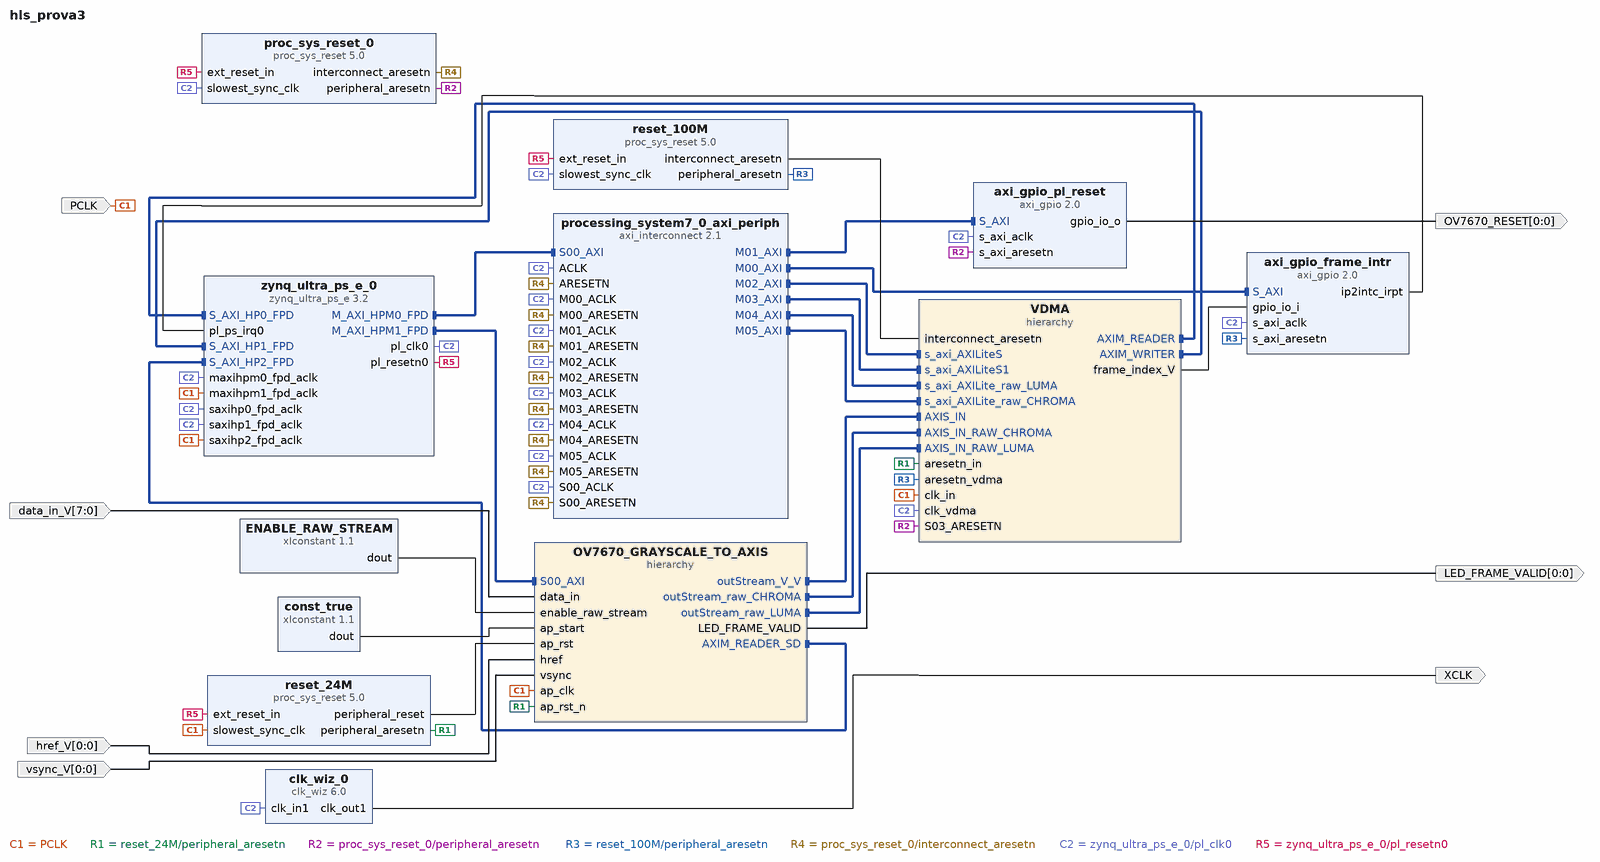
[diagram p0: block diagram of the top level]
# Vivado block design hls_prova3, xczu3eg-sbva484-1-e, Vivado 2018.1
create_bd_design hls_prova3

create_bd_port -dir O -from 0 -to 0 -type data LED_FRAME_VALID
create_bd_port -dir I -type clk PCLK
set_property -dict {CONFIG.FREQ_HZ 24000000} [get_bd_ports PCLK]
create_bd_port -dir O -type clk XCLK
create_bd_port -dir I -from 7 -to 0 -type data data_in_V
set_property -dict [list \
  CONFIG.LAYERED_METADATA {xilinx.com:interface:datatypes:1.0 {DATA {datatype {name {attribs {resolve_type immediate dependency {} format string minimum {} maximum {}} value {}} bitwidth {attribs {resolve_type immediate dependency {} format long minimum {} maximum {}} value 8} bitoffset {attribs {resolve_type immediate dependency {} format long minimum {} maximum {}} value 0} integer {signed {attribs {resolve_type immediate dependency {} format bool minimum {} maximum {}} value false}}}}}} \
] [get_bd_ports data_in_V]
create_bd_port -dir O -from 0 -to 0 -type rst OV7670_RESET
create_bd_port -dir I -from 0 -to 0 -type data href_V
set_property -dict [list \
  CONFIG.LAYERED_METADATA {xilinx.com:interface:datatypes:1.0 {DATA {datatype {name {attribs {resolve_type immediate dependency {} format string minimum {} maximum {}} value {}} bitwidth {attribs {resolve_type immediate dependency {} format long minimum {} maximum {}} value 1} bitoffset {attribs {resolve_type immediate dependency {} format long minimum {} maximum {}} value 0} integer {signed {attribs {resolve_type immediate dependency {} format bool minimum {} maximum {}} value false}}}}}} \
] [get_bd_ports href_V]
create_bd_port -dir I -from 0 -to 0 -type data vsync_V
set_property -dict [list \
  CONFIG.LAYERED_METADATA {xilinx.com:interface:datatypes:1.0 {DATA {datatype {name {attribs {resolve_type immediate dependency {} format string minimum {} maximum {}} value {}} bitwidth {attribs {resolve_type immediate dependency {} format long minimum {} maximum {}} value 1} bitoffset {attribs {resolve_type immediate dependency {} format long minimum {} maximum {}} value 0} integer {signed {attribs {resolve_type immediate dependency {} format bool minimum {} maximum {}} value false}}}}}} \
] [get_bd_ports vsync_V]

create_bd_cell -type ip -vlnv xilinx.com:ip:xlconstant:1.1 ENABLE_RAW_STREAM
set_property -dict {CONFIG.CONST_VAL 1} [get_bd_cells ENABLE_RAW_STREAM]
create_bd_cell -type hier OV7670_GRAYSCALE_TO_AXIS
create_bd_cell -type hier VDMA
create_bd_cell -type ip -vlnv xilinx.com:ip:axi_gpio:2.0 axi_gpio_frame_intr
set_property -dict {CONFIG.C_GPIO_WIDTH 8 CONFIG.C_ALL_INPUTS 1 CONFIG.C_INTERRUPT_PRESENT 1} [get_bd_cells axi_gpio_frame_intr]
create_bd_cell -type ip -vlnv xilinx.com:ip:axi_gpio:2.0 axi_gpio_pl_reset
set_property -dict [list \
  CONFIG.C_GPIO_WIDTH 1 \
  CONFIG.C_ALL_INPUTS 0 \
  CONFIG.C_DOUT_DEFAULT 0x00000001 \
  CONFIG.C_ALL_OUTPUTS 1 \
] [get_bd_cells axi_gpio_pl_reset]
create_bd_cell -type ip -vlnv xilinx.com:ip:clk_wiz:6.0 clk_wiz_0
set_property -dict [list \
  CONFIG.USE_PHASE_ALIGNMENT true \
  CONFIG.PHASESHIFT_MODE WAVEFORM \
  CONFIG.SECONDARY_SOURCE Single_ended_clock_capable_pin \
  CONFIG.CLKOUT1_USED true \
  CONFIG.CLKOUT2_USED false \
  CONFIG.NUM_OUT_CLKS 1 \
  CONFIG.CLKOUT1_REQUESTED_OUT_FREQ 24.001 \
  CONFIG.CLKOUT2_REQUESTED_OUT_FREQ 100.000 \
  CONFIG.CLKOUT1_DRIVES Buffer \
  CONFIG.CLKOUT2_DRIVES Buffer \
  CONFIG.CLKOUT3_DRIVES Buffer \
  CONFIG.CLKOUT4_DRIVES Buffer \
  CONFIG.CLKOUT5_DRIVES Buffer \
  CONFIG.CLKOUT6_DRIVES Buffer \
  CONFIG.CLKOUT7_DRIVES Buffer \
  CONFIG.USE_LOCKED false \
  CONFIG.USE_RESET false \
  CONFIG.MMCM_DIVCLK_DIVIDE 6 \
  CONFIG.MMCM_CLKFBOUT_MULT_F 60.125 \
  CONFIG.MMCM_CLKOUT0_DIVIDE_F 41.750 \
  CONFIG.MMCM_CLKOUT1_DIVIDE 1 \
  CONFIG.CLKOUT1_JITTER 329.137 \
  CONFIG.CLKOUT1_PHASE_ERROR 404.105 \
  CONFIG.CLKOUT2_JITTER 204.875 \
  CONFIG.CLKOUT2_PHASE_ERROR 276.131 \
] [get_bd_cells clk_wiz_0]
create_bd_cell -type ip -vlnv xilinx.com:ip:xlconstant:1.1 const_true
create_bd_cell -type ip -vlnv xilinx.com:ip:proc_sys_reset:5.0 proc_sys_reset_0
create_bd_cell -type ip -vlnv xilinx.com:ip:axi_interconnect:2.1 processing_system7_0_axi_periph
set_property -dict {CONFIG.NUM_MI 6 CONFIG.SYNCHRONIZATION_STAGES 2} [get_bd_cells processing_system7_0_axi_periph]
create_bd_cell -type ip -vlnv xilinx.com:ip:proc_sys_reset:5.0 reset_100M
create_bd_cell -type ip -vlnv xilinx.com:ip:proc_sys_reset:5.0 reset_24M
create_bd_cell -type ip -vlnv xilinx.com:ip:zynq_ultra_ps_e:3.2 zynq_ultra_ps_e_0
set_property -dict [list \
  CONFIG.PSU__PSS_REF_CLK__FREQMHZ 33.333333 \
  CONFIG.PSU__CAN1__PERIPHERAL__ENABLE 0 \
  CONFIG.PSU__DPAUX__PERIPHERAL__ENABLE 1 \
  CONFIG.PSU__DPAUX__PERIPHERAL__IO {MIO 27 .. 30} \
  CONFIG.PSU__FPGA_PL0_ENABLE 1 \
  CONFIG.PSU__ENET3__PERIPHERAL__ENABLE 0 \
  CONFIG.PSU__GPIO0_MIO__PERIPHERAL__ENABLE 1 \
  CONFIG.PSU__GPIO0_MIO__IO {MIO 0 .. 25} \
  CONFIG.PSU__GPIO1_MIO__PERIPHERAL__ENABLE 1 \
  CONFIG.PSU__GPIO1_MIO__IO {MIO 26 .. 51} \
  CONFIG.PSU__GPIO2_MIO__PERIPHERAL__ENABLE 1 \
  CONFIG.PSU__GPIO2_MIO__IO {MIO 52 .. 77} \
  CONFIG.PSU__I2C0__PERIPHERAL__ENABLE 0 \
  CONFIG.PSU__I2C1__PERIPHERAL__ENABLE 1 \
  CONFIG.PSU__I2C1__PERIPHERAL__IO {MIO 4 .. 5} \
  CONFIG.PSU__GT__LINK_SPEED HBR \
  CONFIG.PSU__GT__VLT_SWNG_LVL_4 0 \
  CONFIG.PSU__GT__PRE_EMPH_LVL_4 0 \
  CONFIG.PSU__USB0__REF_CLK_SEL {Ref Clk0} \
  CONFIG.PSU__USB0__REF_CLK_FREQ 26 \
  CONFIG.PSU__USB1__REF_CLK_SEL {Ref Clk0} \
  CONFIG.PSU__USB1__REF_CLK_FREQ 26 \
  CONFIG.PSU__DP__REF_CLK_SEL {Ref Clk1} \
  CONFIG.PSU__DP__REF_CLK_FREQ 27 \
  CONFIG.PSU__DP__LANE_SEL {Dual Lower} \
  CONFIG.SUBPRESET1 Custom \
  CONFIG.SUBPRESET2 Custom \
  CONFIG.PSU__PMU__AIBACK__ENABLE 0 \
  CONFIG.PSU__PMU__PLERROR__ENABLE 0 \
  CONFIG.PSU__PMU__PERIPHERAL__ENABLE 1 \
  CONFIG.PSU__PMU__EMIO_GPI__ENABLE 0 \
  CONFIG.PSU__PMU__EMIO_GPO__ENABLE 0 \
  CONFIG.PSU__PMU__GPI0__ENABLE 1 \
  CONFIG.PSU__PMU__GPI1__ENABLE 0 \
  CONFIG.PSU__PMU__GPI2__ENABLE 0 \
  CONFIG.PSU__PMU__GPI3__ENABLE 0 \
  CONFIG.PSU__PMU__GPI4__ENABLE 0 \
  CONFIG.PSU__PMU__GPI5__ENABLE 0 \
  CONFIG.PSU__PMU__GPO0__ENABLE 1 \
  CONFIG.PSU__PMU__GPO1__ENABLE 1 \
  CONFIG.PSU__PMU__GPO2__ENABLE 1 \
  CONFIG.PSU__PMU__GPO3__ENABLE 0 \
  CONFIG.PSU__PMU__GPO4__ENABLE 0 \
  CONFIG.PSU__PMU__GPO5__ENABLE 0 \
  CONFIG.PSU__PMU__GPI0__IO {MIO 26} \
  CONFIG.PSU__PMU__GPO0__IO {MIO 32} \
  CONFIG.PSU__PMU__GPO1__IO {MIO 33} \
  CONFIG.PSU__PMU__GPO2__IO {MIO 34} \
  CONFIG.PSU__PMU__GPO2__POLARITY high \
  CONFIG.PSU__QSPI__PERIPHERAL__ENABLE 0 \
  CONFIG.PSU__SD0__PERIPHERAL__ENABLE 1 \
  CONFIG.PSU__SD0__PERIPHERAL__IO {MIO 13 .. 16 21 22} \
  CONFIG.PSU__SD0__GRP_CD__ENABLE 1 \
  CONFIG.PSU__SD0__GRP_CD__IO {MIO 24} \
  CONFIG.PSU__SD0__SLOT_TYPE {SD 2.0} \
  CONFIG.PSU__SD0__DATA_TRANSFER_MODE 4Bit \
  CONFIG.PSU__SD1__PERIPHERAL__ENABLE 1 \
  CONFIG.PSU__SD1__PERIPHERAL__IO {MIO 46 .. 51} \
  CONFIG.PSU__SD1__GRP_CD__ENABLE 0 \
  CONFIG.PSU__SD1__GRP_POW__ENABLE 0 \
  CONFIG.PSU__SD1__GRP_WP__ENABLE 0 \
  CONFIG.PSU__SD1__SLOT_TYPE {SD 2.0} \
  CONFIG.PSU__SD1__DATA_TRANSFER_MODE 4Bit \
  CONFIG.PSU__DEVICE_TYPE EG \
  CONFIG.PSU__SPI0__PERIPHERAL__ENABLE 1 \
  CONFIG.PSU__SPI0__PERIPHERAL__IO {MIO 38 .. 43} \
  CONFIG.PSU__SPI0__GRP_SS0__IO {MIO 41} \
  CONFIG.PSU__SPI1__PERIPHERAL__ENABLE 1 \
  CONFIG.PSU__SPI1__PERIPHERAL__IO {MIO 6 .. 11} \
  CONFIG.PSU__SPI1__GRP_SS0__IO {MIO 9} \
  CONFIG.PSU__SWDT0__PERIPHERAL__ENABLE 1 \
  CONFIG.PSU__SWDT0__CLOCK__ENABLE 0 \
  CONFIG.PSU__SWDT0__RESET__ENABLE 0 \
  CONFIG.PSU__SWDT1__PERIPHERAL__ENABLE 1 \
  CONFIG.PSU__SWDT1__CLOCK__ENABLE 0 \
  CONFIG.PSU__SWDT1__RESET__ENABLE 0 \
  CONFIG.PSU__UART0__BAUD_RATE 115200 \
  CONFIG.PSU__TTC0__PERIPHERAL__ENABLE 1 \
  CONFIG.PSU__TTC0__CLOCK__ENABLE 0 \
  CONFIG.PSU__TTC0__WAVEOUT__ENABLE 0 \
  CONFIG.PSU__TTC1__PERIPHERAL__ENABLE 1 \
  CONFIG.PSU__UART1__BAUD_RATE 115200 \
  CONFIG.PSU__TTC1__CLOCK__ENABLE 0 \
  CONFIG.PSU__TTC1__WAVEOUT__ENABLE 0 \
  CONFIG.PSU__TTC2__PERIPHERAL__ENABLE 1 \
  CONFIG.PSU__TTC2__CLOCK__ENABLE 0 \
  CONFIG.PSU__TTC2__WAVEOUT__ENABLE 0 \
  CONFIG.PSU__TTC3__PERIPHERAL__ENABLE 1 \
  CONFIG.PSU__TTC3__CLOCK__ENABLE 0 \
  CONFIG.PSU__TTC3__WAVEOUT__ENABLE 0 \
  CONFIG.PSU__CSUPMU__PERIPHERAL__VALID 1 \
  CONFIG.PSU__DDRC__BUS_WIDTH {32 Bit} \
  CONFIG.PSU__DDRC__DEVICE_CAPACITY {16384 MBits} \
  CONFIG.PSU__DDRC__DRAM_WIDTH {32 Bits} \
  CONFIG.PSU__DDRC__ECC Disabled \
  CONFIG.PSU__DDRC__MEMORY_TYPE {LPDDR 4} \
  CONFIG.PSU__DDRC__SPEED_BIN LPDDR4_1066 \
  CONFIG.PSU__UART0__PERIPHERAL__ENABLE 1 \
  CONFIG.PSU__UART0__PERIPHERAL__IO {MIO 2 .. 3} \
  CONFIG.PSU__UART0__MODEM__ENABLE 0 \
  CONFIG.PSU__UART1__PERIPHERAL__ENABLE 1 \
  CONFIG.PSU__UART1__PERIPHERAL__IO {MIO 0 .. 1} \
  CONFIG.PSU__UART1__MODEM__ENABLE 0 \
  CONFIG.PSU__USB0__PERIPHERAL__ENABLE 1 \
  CONFIG.PSU__USB0__PERIPHERAL__IO {MIO 52 .. 63} \
  CONFIG.PSU__USB1__PERIPHERAL__ENABLE 1 \
  CONFIG.PSU__USB1__PERIPHERAL__IO {MIO 64 .. 75} \
  CONFIG.PSU__USB3_0__PERIPHERAL__ENABLE 1 \
  CONFIG.PSU__USB3_0__PERIPHERAL__IO {GT Lane2} \
  CONFIG.PSU__USB3_1__PERIPHERAL__ENABLE 1 \
  CONFIG.PSU__USB3_1__PERIPHERAL__IO {GT Lane3} \
  CONFIG.PSU__USB3_0__EMIO__ENABLE 0 \
  CONFIG.PSU__USB2_0__EMIO__ENABLE 0 \
  CONFIG.PSU__USE__M_AXI_GP0 1 \
  CONFIG.PSU__MAXIGP0__DATA_WIDTH 128 \
  CONFIG.PSU__USE__M_AXI_GP1 1 \
  CONFIG.PSU__USE__M_AXI_GP2 0 \
  CONFIG.PSU__USE__S_AXI_GP2 1 \
  CONFIG.PSU__SAXIGP2__DATA_WIDTH 64 \
  CONFIG.PSU__USE__S_AXI_GP3 1 \
  CONFIG.PSU__SAXIGP3__DATA_WIDTH 64 \
  CONFIG.PSU__USE__S_AXI_GP4 1 \
  CONFIG.PSU__SAXIGP4__DATA_WIDTH 64 \
  CONFIG.PSU__USE__IRQ0 1 \
  CONFIG.PSU__PRESET_APPLIED 1 \
  CONFIG.PSU__HIGH_ADDRESS__ENABLE 0 \
  CONFIG.PSU__DDR_HIGH_ADDRESS_GUI_ENABLE 0 \
  CONFIG.PSU_BANK_0_IO_STANDARD LVCMOS18 \
  CONFIG.PSU_BANK_1_IO_STANDARD LVCMOS18 \
  CONFIG.PSU_BANK_2_IO_STANDARD LVCMOS18 \
  CONFIG.PSU_BANK_3_IO_STANDARD LVCMOS18 \
  CONFIG.PSU__CRL_APB__IOPLL_CTRL__DIV2 0 \
  CONFIG.PSU__DISPLAYPORT__PERIPHERAL__ENABLE 1 \
  CONFIG.PSU__DISPLAYPORT__LANE0__ENABLE 1 \
  CONFIG.PSU__DISPLAYPORT__LANE0__IO {GT Lane1} \
  CONFIG.PSU__DISPLAYPORT__LANE1__ENABLE 1 \
  CONFIG.PSU__DISPLAYPORT__LANE1__IO {GT Lane0} \
  CONFIG.PSU__SATA__PERIPHERAL__ENABLE 0 \
  CONFIG.PSU__CRL_APB__USB3__ENABLE 1 \
  CONFIG.PSU__CRF_APB__APLL_CTRL__SRCSEL PSS_REF_CLK \
  CONFIG.PSU__CRF_APB__DPLL_CTRL__SRCSEL PSS_REF_CLK \
  CONFIG.PSU__CRF_APB__VPLL_CTRL__SRCSEL PSS_REF_CLK \
  CONFIG.PSU__CRF_APB__ACPU_CTRL__SRCSEL APLL \
  CONFIG.PSU__CRF_APB__DBG_TRACE_CTRL__SRCSEL IOPLL \
  CONFIG.PSU__CRF_APB__DBG_FPD_CTRL__SRCSEL IOPLL \
  CONFIG.PSU__CRF_APB__DP_VIDEO_REF_CTRL__SRCSEL VPLL \
  CONFIG.PSU__CRF_APB__DP_AUDIO_REF_CTRL__SRCSEL RPLL \
  CONFIG.PSU__CRF_APB__DP_STC_REF_CTRL__SRCSEL RPLL \
  CONFIG.PSU__CRF_APB__DDR_CTRL__SRCSEL DPLL \
  CONFIG.PSU__CRF_APB__GPU_REF_CTRL__SRCSEL IOPLL \
  CONFIG.PSU__CRL_APB__PL0_REF_CTRL__SRCSEL IOPLL \
  CONFIG.PSU__CRF_APB__GDMA_REF_CTRL__SRCSEL APLL \
  CONFIG.PSU__CRF_APB__DPDMA_REF_CTRL__SRCSEL APLL \
  CONFIG.PSU__CRF_APB__TOPSW_MAIN_CTRL__SRCSEL DPLL \
  CONFIG.PSU__CRF_APB__TOPSW_LSBUS_CTRL__SRCSEL IOPLL \
  CONFIG.PSU__CRF_APB__DBG_TSTMP_CTRL__SRCSEL IOPLL \
  CONFIG.PSU__CRL_APB__IOPLL_CTRL__SRCSEL PSS_REF_CLK \
  CONFIG.PSU__CRL_APB__RPLL_CTRL__SRCSEL PSS_REF_CLK \
  CONFIG.PSU__CRL_APB__GEM3_REF_CTRL__SRCSEL IOPLL \
  CONFIG.PSU__CRL_APB__USB0_BUS_REF_CTRL__SRCSEL IOPLL \
  CONFIG.PSU__CRL_APB__QSPI_REF_CTRL__SRCSEL IOPLL \
  CONFIG.PSU__CRL_APB__SDIO0_REF_CTRL__SRCSEL IOPLL \
  CONFIG.PSU__CRL_APB__SDIO1_REF_CTRL__SRCSEL IOPLL \
  CONFIG.PSU__CRL_APB__UART0_REF_CTRL__SRCSEL IOPLL \
  CONFIG.PSU__CRL_APB__UART1_REF_CTRL__SRCSEL IOPLL \
  CONFIG.PSU__CRL_APB__I2C0_REF_CTRL__SRCSEL IOPLL \
  CONFIG.PSU__CRL_APB__I2C1_REF_CTRL__SRCSEL IOPLL \
  CONFIG.PSU__CRL_APB__SPI0_REF_CTRL__SRCSEL IOPLL \
  CONFIG.PSU__CRL_APB__SPI1_REF_CTRL__SRCSEL IOPLL \
  CONFIG.PSU__CRL_APB__CAN1_REF_CTRL__SRCSEL IOPLL \
  CONFIG.PSU__CRL_APB__CPU_R5_CTRL__SRCSEL IOPLL \
  CONFIG.PSU__CRL_APB__IOU_SWITCH_CTRL__SRCSEL IOPLL \
  CONFIG.PSU__CRL_APB__CSU_PLL_CTRL__SRCSEL IOPLL \
  CONFIG.PSU__CRL_APB__PCAP_CTRL__SRCSEL IOPLL \
  CONFIG.PSU__CRL_APB__LPD_LSBUS_CTRL__SRCSEL IOPLL \
  CONFIG.PSU__CRL_APB__LPD_SWITCH_CTRL__SRCSEL IOPLL \
  CONFIG.PSU__CRL_APB__DBG_LPD_CTRL__SRCSEL IOPLL \
  CONFIG.PSU__CRL_APB__ADMA_REF_CTRL__SRCSEL IOPLL \
  CONFIG.PSU__CRL_APB__TIMESTAMP_REF_CTRL__SRCSEL IOPLL \
  CONFIG.PSU__CRL_APB__USB3_DUAL_REF_CTRL__SRCSEL IOPLL \
  CONFIG.PSU__IOU_SLCR__IOU_TTC_APB_CLK__TTC0_SEL APB \
  CONFIG.PSU__IOU_SLCR__IOU_TTC_APB_CLK__TTC1_SEL APB \
  CONFIG.PSU__IOU_SLCR__IOU_TTC_APB_CLK__TTC2_SEL APB \
  CONFIG.PSU__IOU_SLCR__IOU_TTC_APB_CLK__TTC3_SEL APB \
  CONFIG.PSU__CRF_APB__VPLL_FRAC_CFG__ENABLED 1 \
  CONFIG.PSU__CRL_APB__RPLL_FRAC_CFG__ENABLED 1 \
  CONFIG.PSU__OVERRIDE__BASIC_CLOCK 1 \
  CONFIG.PSU__DLL__ISUSED 1 \
  CONFIG.PSU__DDR__INTERFACE__FREQMHZ 266.500 \
  CONFIG.PSU__CRF_APB__ACPU_CTRL__FREQMHZ 1200 \
  CONFIG.PSU__CRF_APB__DBG_TRACE_CTRL__FREQMHZ 250 \
  CONFIG.PSU__CRF_APB__DBG_FPD_CTRL__FREQMHZ 250 \
  CONFIG.PSU__CRF_APB__DDR_CTRL__FREQMHZ 533 \
  CONFIG.PSU__CRF_APB__GPU_REF_CTRL__FREQMHZ 600 \
  CONFIG.PSU__CRL_APB__PL0_REF_CTRL__FREQMHZ 100 \
  CONFIG.PSU__CRF_APB__GDMA_REF_CTRL__FREQMHZ 600 \
  CONFIG.PSU__CRF_APB__DPDMA_REF_CTRL__FREQMHZ 600 \
  CONFIG.PSU__CRF_APB__TOPSW_MAIN_CTRL__FREQMHZ 533.333 \
  CONFIG.PSU__CRF_APB__TOPSW_LSBUS_CTRL__FREQMHZ 100 \
  CONFIG.PSU__CRF_APB__DBG_TSTMP_CTRL__FREQMHZ 250 \
  CONFIG.PSU__CRL_APB__GEM3_REF_CTRL__FREQMHZ 125 \
  CONFIG.PSU__CRL_APB__USB0_BUS_REF_CTRL__FREQMHZ 250 \
  CONFIG.PSU__CRL_APB__QSPI_REF_CTRL__FREQMHZ 300 \
  CONFIG.PSU__CRL_APB__SDIO1_REF_CTRL__FREQMHZ 200 \
  CONFIG.PSU__CRL_APB__UART0_REF_CTRL__FREQMHZ 100 \
  CONFIG.PSU__CRL_APB__UART1_REF_CTRL__FREQMHZ 100 \
  CONFIG.PSU__CRL_APB__I2C0_REF_CTRL__FREQMHZ 100 \
  CONFIG.PSU__CRL_APB__I2C1_REF_CTRL__FREQMHZ 100 \
  CONFIG.PSU__CRL_APB__CAN1_REF_CTRL__FREQMHZ 100 \
  CONFIG.PSU__CRL_APB__CPU_R5_CTRL__FREQMHZ 500 \
  CONFIG.PSU__CRL_APB__IOU_SWITCH_CTRL__FREQMHZ 267 \
  CONFIG.PSU__CRL_APB__CSU_PLL_CTRL__FREQMHZ 400 \
  CONFIG.PSU__CRL_APB__PCAP_CTRL__FREQMHZ 200 \
  CONFIG.PSU__CRL_APB__LPD_LSBUS_CTRL__FREQMHZ 100 \
  CONFIG.PSU__CRL_APB__LPD_SWITCH_CTRL__FREQMHZ 500 \
  CONFIG.PSU__CRL_APB__DBG_LPD_CTRL__FREQMHZ 250 \
  CONFIG.PSU__CRL_APB__ADMA_REF_CTRL__FREQMHZ 500 \
  CONFIG.PSU__CRL_APB__TIMESTAMP_REF_CTRL__FREQMHZ 100 \
  CONFIG.PSU__CRL_APB__USB3_DUAL_REF_CTRL__FREQMHZ 20 \
  CONFIG.IIC0_BOARD_INTERFACE custom \
  CONFIG.IIC1_BOARD_INTERFACE custom \
  CONFIG.QSPI_BOARD_INTERFACE custom \
  CONFIG.NAND_BOARD_INTERFACE custom \
  CONFIG.SD0_BOARD_INTERFACE custom \
  CONFIG.SD1_BOARD_INTERFACE custom \
  CONFIG.CAN0_BOARD_INTERFACE custom \
  CONFIG.CAN1_BOARD_INTERFACE custom \
  CONFIG.PJTAG_BOARD_INTERFACE custom \
  CONFIG.PMU_BOARD_INTERFACE custom \
  CONFIG.CSU_BOARD_INTERFACE custom \
  CONFIG.SPI0_BOARD_INTERFACE custom \
  CONFIG.SPI1_BOARD_INTERFACE custom \
  CONFIG.UART0_BOARD_INTERFACE custom \
  CONFIG.UART1_BOARD_INTERFACE custom \
  CONFIG.GPIO_BOARD_INTERFACE custom \
  CONFIG.SWDT0_BOARD_INTERFACE custom \
  CONFIG.SWDT1_BOARD_INTERFACE custom \
  CONFIG.TRACE_BOARD_INTERFACE custom \
  CONFIG.TTC0_BOARD_INTERFACE custom \
  CONFIG.TTC1_BOARD_INTERFACE custom \
  CONFIG.TTC2_BOARD_INTERFACE custom \
  CONFIG.TTC3_BOARD_INTERFACE custom \
  CONFIG.GEM0_BOARD_INTERFACE custom \
  CONFIG.GEM1_BOARD_INTERFACE custom \
  CONFIG.GEM2_BOARD_INTERFACE custom \
  CONFIG.GEM3_BOARD_INTERFACE custom \
  CONFIG.USB0_BOARD_INTERFACE custom \
  CONFIG.USB1_BOARD_INTERFACE custom \
  CONFIG.PCIE_BOARD_INTERFACE custom \
  CONFIG.DP_BOARD_INTERFACE custom \
  CONFIG.SATA_BOARD_INTERFACE custom \
  CONFIG.PSU__PMU_COHERENCY 0 \
  CONFIG.PSU__USB0_COHERENCY 0 \
  CONFIG.PSU__SD1_COHERENCY 0 \
] [get_bd_cells zynq_ultra_ps_e_0]
# 845 more settings of zynq_ultra_ps_e_0 are not shown: defaults, MIO pin electricals, DDR timing, and values the tool derives

# ---- hierarchy /OV7670_GRAYSCALE_TO_AXIS ----
current_bd_instance /OV7670_GRAYSCALE_TO_AXIS
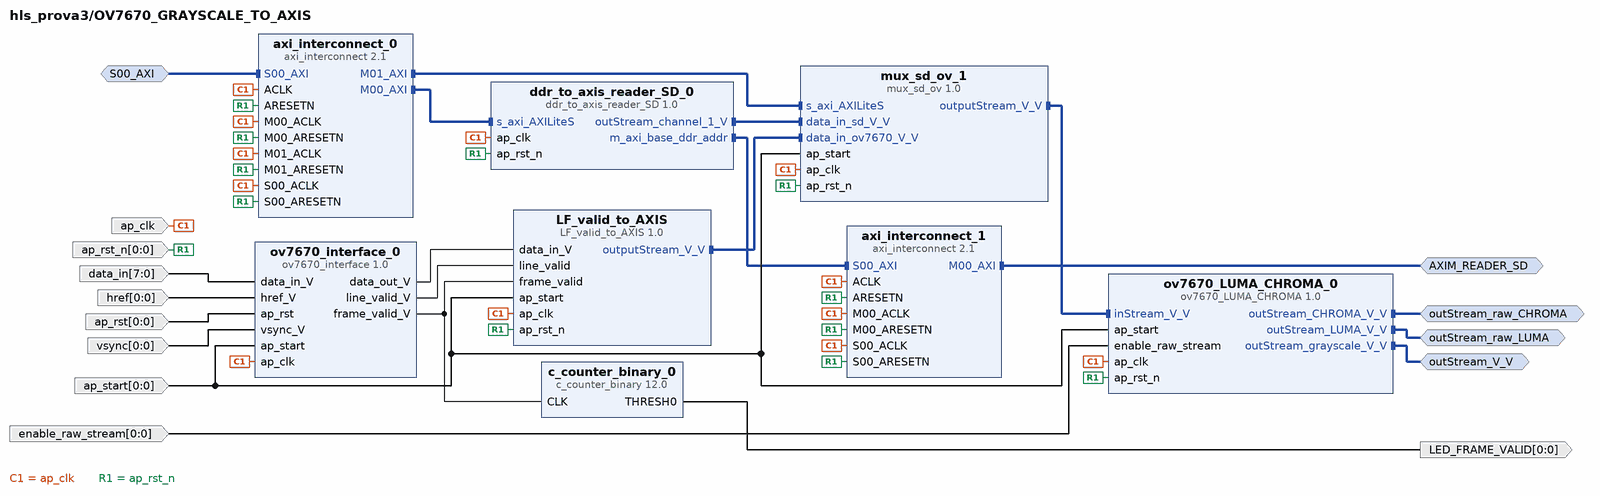
[diagram p1: block diagram inside /OV7670_GRAYSCALE_TO_AXIS]
create_bd_intf_pin -mode Master -vlnv xilinx.com:interface:aximm_rtl:1.0 AXIM_READER_SD
create_bd_intf_pin -mode Slave -vlnv xilinx.com:interface:aximm_rtl:1.0 S00_AXI
create_bd_intf_pin -mode Master -vlnv xilinx.com:interface:axis_rtl:1.0 outStream_V_V
create_bd_intf_pin -mode Master -vlnv xilinx.com:interface:axis_rtl:1.0 outStream_raw_CHROMA
create_bd_intf_pin -mode Master -vlnv xilinx.com:interface:axis_rtl:1.0 outStream_raw_LUMA
create_bd_pin -dir O -from 0 -to 0 -type data LED_FRAME_VALID
create_bd_pin -dir I -type clk ap_clk
create_bd_pin -dir I -from 0 -to 0 -type rst ap_rst
create_bd_pin -dir I -from 0 -to 0 -type rst ap_rst_n
create_bd_pin -dir I -from 0 -to 0 ap_start
create_bd_pin -dir I -from 7 -to 0 -type data data_in
create_bd_pin -dir I -from 0 -to 0 -type data enable_raw_stream
create_bd_pin -dir I -from 0 -to 0 -type data href
create_bd_pin -dir I -from 0 -to 0 -type data vsync

create_bd_cell -type ip -vlnv xilinx.com:hls:LF_valid_to_AXIS:1.0 LF_valid_to_AXIS
create_bd_cell -type ip -vlnv xilinx.com:ip:axi_interconnect:2.1 axi_interconnect_1
set_property -dict {CONFIG.NUM_MI 1 CONFIG.SYNCHRONIZATION_STAGES 2} [get_bd_cells axi_interconnect_1]
create_bd_cell -type ip -vlnv xilinx.com:ip:c_counter_binary:12.0 c_counter_binary_0
set_property -dict [list \
  CONFIG.Output_Width 4 \
  CONFIG.Restrict_Count false \
  CONFIG.Sync_Threshold_Output true \
  CONFIG.Threshold_Value F \
] [get_bd_cells c_counter_binary_0]
create_bd_cell -type ip -vlnv xilinx.com:hls:ddr_to_axis_reader_SD:1.0 ddr_to_axis_reader_SD_0
create_bd_cell -type ip -vlnv xilinx.com:hls:mux_sd_ov:1.0 mux_sd_ov_1
create_bd_cell -type ip -vlnv xilinx.com:hls:ov7670_LUMA_CHROMA:1.0 ov7670_LUMA_CHROMA_0
create_bd_cell -type ip -vlnv xilinx.com:hls:ov7670_interface:1.0 ov7670_interface_0
create_bd_cell -type ip -vlnv xilinx.com:ip:axi_interconnect:2.1 axi_interconnect_0
set_property -dict {CONFIG.NUM_MI 2 CONFIG.SYNCHRONIZATION_STAGES 2} [get_bd_cells axi_interconnect_0]

# ---- hierarchy /VDMA ----
current_bd_instance /VDMA
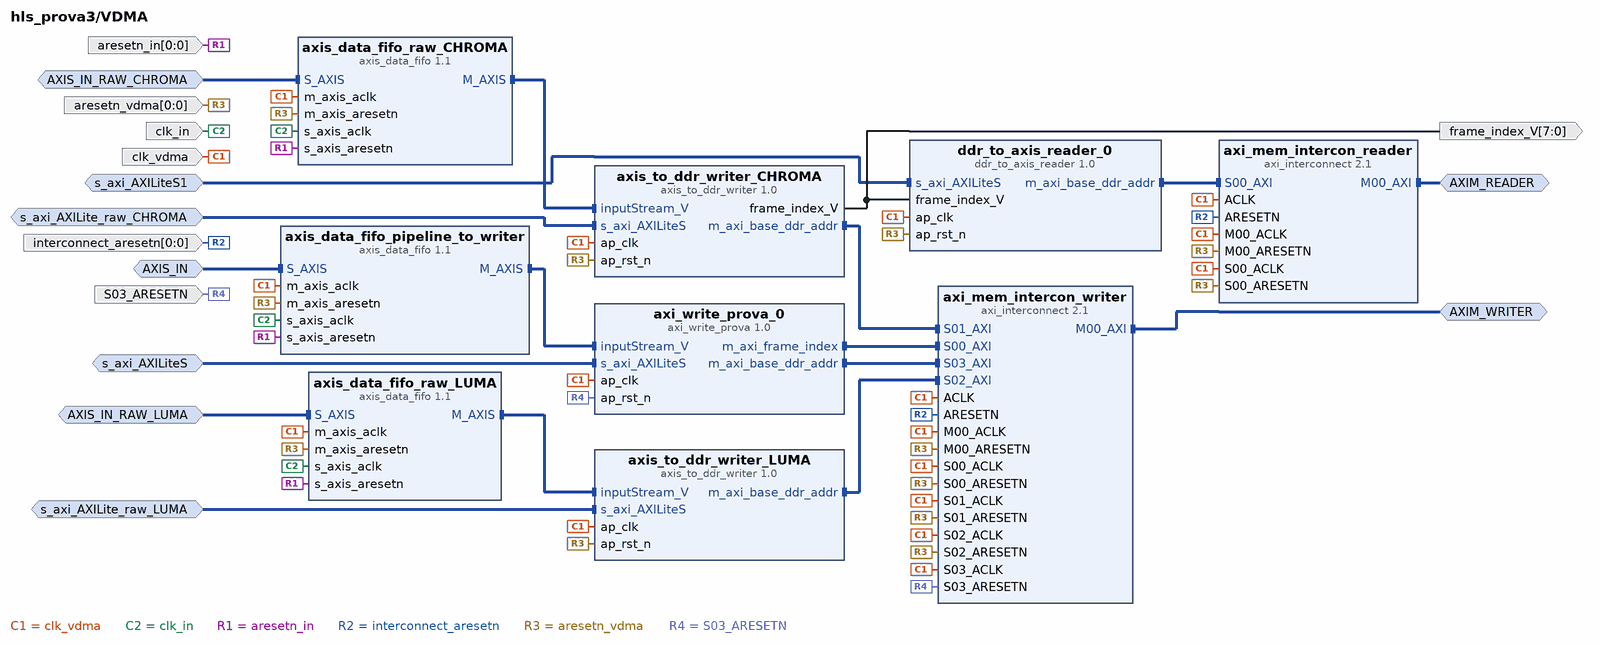
[diagram p2: block diagram inside /VDMA]
create_bd_intf_pin -mode Master -vlnv xilinx.com:interface:aximm_rtl:1.0 AXIM_READER
create_bd_intf_pin -mode Master -vlnv xilinx.com:interface:aximm_rtl:1.0 AXIM_WRITER
create_bd_intf_pin -mode Slave -vlnv xilinx.com:interface:axis_rtl:1.0 AXIS_IN
create_bd_intf_pin -mode Slave -vlnv xilinx.com:interface:axis_rtl:1.0 AXIS_IN_RAW_CHROMA
create_bd_intf_pin -mode Slave -vlnv xilinx.com:interface:axis_rtl:1.0 AXIS_IN_RAW_LUMA
create_bd_intf_pin -mode Slave -vlnv xilinx.com:interface:aximm_rtl:1.0 s_axi_AXILiteS
create_bd_intf_pin -mode Slave -vlnv xilinx.com:interface:aximm_rtl:1.0 s_axi_AXILiteS1
create_bd_intf_pin -mode Slave -vlnv xilinx.com:interface:aximm_rtl:1.0 s_axi_AXILite_raw_CHROMA
create_bd_intf_pin -mode Slave -vlnv xilinx.com:interface:aximm_rtl:1.0 s_axi_AXILite_raw_LUMA
create_bd_pin -dir I -from 0 -to 0 -type rst aresetn_in
create_bd_pin -dir I -from 0 -to 0 -type rst aresetn_vdma
create_bd_pin -dir I -type clk clk_in
create_bd_pin -dir I -type clk clk_vdma
create_bd_pin -dir O -from 7 -to 0 -type data frame_index_V
create_bd_pin -dir I -from 0 -to 0 -type rst interconnect_aresetn
create_bd_pin -dir I -type rst S03_ARESETN

create_bd_cell -type ip -vlnv xilinx.com:ip:axi_interconnect:2.1 axi_mem_intercon_reader
set_property -dict {CONFIG.NUM_MI 1 CONFIG.SYNCHRONIZATION_STAGES 2} [get_bd_cells axi_mem_intercon_reader]
create_bd_cell -type ip -vlnv xilinx.com:ip:axi_interconnect:2.1 axi_mem_intercon_writer
set_property -dict {CONFIG.NUM_SI 4 CONFIG.NUM_MI 1 CONFIG.SYNCHRONIZATION_STAGES 2} [get_bd_cells axi_mem_intercon_writer]
create_bd_cell -type ip -vlnv xilinx.com:ip:axis_data_fifo:1.1 axis_data_fifo_pipeline_to_writer
set_property -dict [list \
  CONFIG.FIFO_DEPTH 1024 \
  CONFIG.IS_ACLK_ASYNC 1 \
  CONFIG.SYNCHRONIZATION_STAGES 2 \
] [get_bd_cells axis_data_fifo_pipeline_to_writer]
create_bd_cell -type ip -vlnv xilinx.com:ip:axis_data_fifo:1.1 axis_data_fifo_raw_CHROMA
set_property -dict [list \
  CONFIG.FIFO_DEPTH 1024 \
  CONFIG.IS_ACLK_ASYNC 1 \
  CONFIG.SYNCHRONIZATION_STAGES 2 \
] [get_bd_cells axis_data_fifo_raw_CHROMA]
create_bd_cell -type ip -vlnv xilinx.com:ip:axis_data_fifo:1.1 axis_data_fifo_raw_LUMA
set_property -dict [list \
  CONFIG.FIFO_DEPTH 1024 \
  CONFIG.IS_ACLK_ASYNC 1 \
  CONFIG.SYNCHRONIZATION_STAGES 2 \
] [get_bd_cells axis_data_fifo_raw_LUMA]
create_bd_cell -type ip -vlnv xilinx.com:hls:axis_to_ddr_writer:1.0 axis_to_ddr_writer_CHROMA
create_bd_cell -type ip -vlnv xilinx.com:hls:axis_to_ddr_writer:1.0 axis_to_ddr_writer_LUMA
create_bd_cell -type ip -vlnv xilinx.com:hls:ddr_to_axis_reader:1.0 ddr_to_axis_reader_0
create_bd_cell -type ip -vlnv xilinx.com:hls:axi_write_prova:1.0 axi_write_prova_0

# ---- connections ----

current_bd_instance /OV7670_GRAYSCALE_TO_AXIS
connect_bd_intf_net [get_bd_intf_pins LF_valid_to_AXIS/outputStream_V_V] [get_bd_intf_pins mux_sd_ov_1/data_in_ov7670_V_V]
connect_bd_intf_net [get_bd_intf_pins axi_interconnect_1/S00_AXI] [get_bd_intf_pins ddr_to_axis_reader_SD_0/m_axi_base_ddr_addr]
connect_bd_intf_net [get_bd_intf_pins ddr_to_axis_reader_SD_0/outStream_channel_1_V] [get_bd_intf_pins mux_sd_ov_1/data_in_sd_V_V]
connect_bd_intf_net [get_bd_intf_pins mux_sd_ov_1/outputStream_V_V] [get_bd_intf_pins ov7670_LUMA_CHROMA_0/inStream_V_V]
connect_bd_intf_net [get_bd_intf_pins axi_interconnect_0/M01_AXI] [get_bd_intf_pins mux_sd_ov_1/s_axi_AXILiteS]
connect_bd_intf_net [get_bd_intf_pins axi_interconnect_0/M00_AXI] [get_bd_intf_pins ddr_to_axis_reader_SD_0/s_axi_AXILiteS]
connect_bd_intf_net [get_bd_intf_pins AXIM_READER_SD] [get_bd_intf_pins axi_interconnect_1/M00_AXI]
connect_bd_intf_net [get_bd_intf_pins S00_AXI] [get_bd_intf_pins axi_interconnect_0/S00_AXI]
connect_bd_intf_net [get_bd_intf_pins outStream_V_V] [get_bd_intf_pins ov7670_LUMA_CHROMA_0/outStream_grayscale_V_V]
connect_bd_intf_net [get_bd_intf_pins outStream_raw_CHROMA] [get_bd_intf_pins ov7670_LUMA_CHROMA_0/outStream_CHROMA_V_V]
connect_bd_intf_net [get_bd_intf_pins outStream_raw_LUMA] [get_bd_intf_pins ov7670_LUMA_CHROMA_0/outStream_LUMA_V_V]
connect_bd_net -net PCLK_1 [get_bd_pins ap_clk] \
  [get_bd_pins LF_valid_to_AXIS/ap_clk] [get_bd_pins ddr_to_axis_reader_SD_0/ap_clk] [get_bd_pins mux_sd_ov_1/ap_clk] \
  [get_bd_pins ov7670_LUMA_CHROMA_0/ap_clk] [get_bd_pins ov7670_interface_0/ap_clk] [get_bd_pins axi_interconnect_1/ACLK] \
  [get_bd_pins axi_interconnect_1/M00_ACLK] [get_bd_pins axi_interconnect_1/S00_ACLK] [get_bd_pins axi_interconnect_0/ACLK] \
  [get_bd_pins axi_interconnect_0/S00_ACLK] [get_bd_pins axi_interconnect_0/M01_ACLK] \
  [get_bd_pins axi_interconnect_0/M00_ACLK]
connect_bd_net [get_bd_pins ap_start] \
  [get_bd_pins LF_valid_to_AXIS/ap_start] [get_bd_pins mux_sd_ov_1/ap_start] [get_bd_pins ov7670_LUMA_CHROMA_0/ap_start] \
  [get_bd_pins ov7670_interface_0/ap_start]
connect_bd_net [get_bd_pins c_counter_binary_0/THRESH0] [get_bd_pins LED_FRAME_VALID]
connect_bd_net -net data_in_V_1 [get_bd_pins data_in] [get_bd_pins ov7670_interface_0/data_in_V]
connect_bd_net [get_bd_pins enable_raw_stream] [get_bd_pins ov7670_LUMA_CHROMA_0/enable_raw_stream]
connect_bd_net -net href_V_1 [get_bd_pins href] [get_bd_pins ov7670_interface_0/href_V]
connect_bd_net [get_bd_pins ov7670_interface_0/data_out_V] [get_bd_pins LF_valid_to_AXIS/data_in_V]
connect_bd_net [get_bd_pins ov7670_interface_0/frame_valid_V] [get_bd_pins LF_valid_to_AXIS/frame_valid] [get_bd_pins c_counter_binary_0/CLK]
connect_bd_net [get_bd_pins ov7670_interface_0/line_valid_V] [get_bd_pins LF_valid_to_AXIS/line_valid]
connect_bd_net -net proc_sys_reset_0_peripheral_aresetn [get_bd_pins ap_rst_n] \
  [get_bd_pins LF_valid_to_AXIS/ap_rst_n] [get_bd_pins ddr_to_axis_reader_SD_0/ap_rst_n] [get_bd_pins mux_sd_ov_1/ap_rst_n] \
  [get_bd_pins ov7670_LUMA_CHROMA_0/ap_rst_n] [get_bd_pins axi_interconnect_1/ARESETN] \
  [get_bd_pins axi_interconnect_1/M00_ARESETN] [get_bd_pins axi_interconnect_1/S00_ARESETN] \
  [get_bd_pins axi_interconnect_0/ARESETN] [get_bd_pins axi_interconnect_0/S00_ARESETN] \
  [get_bd_pins axi_interconnect_0/M01_ARESETN] [get_bd_pins axi_interconnect_0/M00_ARESETN]
connect_bd_net -net reset_24M_peripheral_reset [get_bd_pins ap_rst] [get_bd_pins ov7670_interface_0/ap_rst]
connect_bd_net -net vsync_V_1 [get_bd_pins vsync] [get_bd_pins ov7670_interface_0/vsync_V]

current_bd_instance /VDMA
connect_bd_intf_net [get_bd_intf_pins axi_mem_intercon_writer/S01_AXI] [get_bd_intf_pins axis_to_ddr_writer_CHROMA/m_axi_base_ddr_addr]
connect_bd_intf_net [get_bd_intf_pins axi_mem_intercon_writer/S02_AXI] [get_bd_intf_pins axis_to_ddr_writer_LUMA/m_axi_base_ddr_addr]
connect_bd_intf_net -intf_net axis_data_fifo_0_M_AXIS [get_bd_intf_pins axis_data_fifo_raw_LUMA/M_AXIS] [get_bd_intf_pins axis_to_ddr_writer_LUMA/inputStream_V]
connect_bd_intf_net -intf_net axis_data_fifo_1_M_AXIS [get_bd_intf_pins axis_data_fifo_raw_CHROMA/M_AXIS] [get_bd_intf_pins axis_to_ddr_writer_CHROMA/inputStream_V]
connect_bd_intf_net [get_bd_intf_pins axi_mem_intercon_reader/S00_AXI] [get_bd_intf_pins ddr_to_axis_reader_0/m_axi_base_ddr_addr]
connect_bd_intf_net [get_bd_intf_pins axi_mem_intercon_writer/S00_AXI] [get_bd_intf_pins axi_write_prova_0/m_axi_frame_index]
connect_bd_intf_net [get_bd_intf_pins axi_write_prova_0/m_axi_base_ddr_addr] [get_bd_intf_pins axi_mem_intercon_writer/S03_AXI]
connect_bd_intf_net [get_bd_intf_pins axis_data_fifo_pipeline_to_writer/M_AXIS] [get_bd_intf_pins axi_write_prova_0/inputStream_V]
connect_bd_intf_net [get_bd_intf_pins AXIM_READER] [get_bd_intf_pins axi_mem_intercon_reader/M00_AXI]
connect_bd_intf_net -intf_net axi_mem_intercon_M00_AXI [get_bd_intf_pins AXIM_WRITER] [get_bd_intf_pins axi_mem_intercon_writer/M00_AXI]
connect_bd_intf_net -intf_net Filter_Convolution_0_out_img_V [get_bd_intf_pins AXIS_IN] [get_bd_intf_pins axis_data_fifo_pipeline_to_writer/S_AXIS]
connect_bd_intf_net [get_bd_intf_pins AXIS_IN_RAW_CHROMA] [get_bd_intf_pins axis_data_fifo_raw_CHROMA/S_AXIS]
connect_bd_intf_net [get_bd_intf_pins AXIS_IN_RAW_LUMA] [get_bd_intf_pins axis_data_fifo_raw_LUMA/S_AXIS]
connect_bd_intf_net [get_bd_intf_pins s_axi_AXILiteS] [get_bd_intf_pins axi_write_prova_0/s_axi_AXILiteS]
connect_bd_intf_net -intf_net s_axi_AXILiteS1_1 [get_bd_intf_pins s_axi_AXILiteS1] [get_bd_intf_pins ddr_to_axis_reader_0/s_axi_AXILiteS]
connect_bd_intf_net [get_bd_intf_pins s_axi_AXILite_raw_CHROMA] [get_bd_intf_pins axis_to_ddr_writer_CHROMA/s_axi_AXILiteS]
connect_bd_intf_net [get_bd_intf_pins s_axi_AXILite_raw_LUMA] [get_bd_intf_pins axis_to_ddr_writer_LUMA/s_axi_AXILiteS]
connect_bd_net -net CLOCK_100M_1 [get_bd_pins clk_vdma] \
  [get_bd_pins axis_data_fifo_pipeline_to_writer/m_axis_aclk] [get_bd_pins axis_data_fifo_raw_CHROMA/m_axis_aclk] \
  [get_bd_pins axis_data_fifo_raw_LUMA/m_axis_aclk] [get_bd_pins axis_to_ddr_writer_CHROMA/ap_clk] \
  [get_bd_pins axis_to_ddr_writer_LUMA/ap_clk] [get_bd_pins ddr_to_axis_reader_0/ap_clk] \
  [get_bd_pins axi_write_prova_0/ap_clk] [get_bd_pins axi_mem_intercon_reader/ACLK] \
  [get_bd_pins axi_mem_intercon_reader/M00_ACLK] [get_bd_pins axi_mem_intercon_reader/S00_ACLK] \
  [get_bd_pins axi_mem_intercon_writer/ACLK] [get_bd_pins axi_mem_intercon_writer/M00_ACLK] \
  [get_bd_pins axi_mem_intercon_writer/S00_ACLK] [get_bd_pins axi_mem_intercon_writer/S01_ACLK] \
  [get_bd_pins axi_mem_intercon_writer/S02_ACLK] [get_bd_pins axi_mem_intercon_writer/S03_ACLK]
connect_bd_net -net PCLK_1 [get_bd_pins clk_in] \
  [get_bd_pins axis_data_fifo_pipeline_to_writer/s_axis_aclk] [get_bd_pins axis_data_fifo_raw_CHROMA/s_axis_aclk] \
  [get_bd_pins axis_data_fifo_raw_LUMA/s_axis_aclk]
connect_bd_net [get_bd_pins aresetn_in] \
  [get_bd_pins axis_data_fifo_pipeline_to_writer/s_axis_aresetn] [get_bd_pins axis_data_fifo_raw_CHROMA/s_axis_aresetn] \
  [get_bd_pins axis_data_fifo_raw_LUMA/s_axis_aresetn]
connect_bd_net -net axis_to_ddr_writer_0_frame_index_V [get_bd_pins axis_to_ddr_writer_CHROMA/frame_index_V] \
  [get_bd_pins frame_index_V] [get_bd_pins ddr_to_axis_reader_0/frame_index_V]
connect_bd_net -net rst_processing_system7_0_100M_interconnect_aresetn [get_bd_pins interconnect_aresetn] \
  [get_bd_pins axi_mem_intercon_reader/ARESETN] [get_bd_pins axi_mem_intercon_writer/ARESETN]
connect_bd_net -net rst_processing_system7_0_100M_peripheral_aresetn [get_bd_pins aresetn_vdma] \
  [get_bd_pins axis_to_ddr_writer_CHROMA/ap_rst_n] [get_bd_pins axis_to_ddr_writer_LUMA/ap_rst_n] \
  [get_bd_pins ddr_to_axis_reader_0/ap_rst_n] [get_bd_pins axis_data_fifo_raw_LUMA/m_axis_aresetn] \
  [get_bd_pins axis_data_fifo_pipeline_to_writer/m_axis_aresetn] [get_bd_pins axis_data_fifo_raw_CHROMA/m_axis_aresetn] \
  [get_bd_pins axi_mem_intercon_reader/M00_ARESETN] [get_bd_pins axi_mem_intercon_reader/S00_ARESETN] \
  [get_bd_pins axi_mem_intercon_writer/M00_ARESETN] [get_bd_pins axi_mem_intercon_writer/S00_ARESETN] \
  [get_bd_pins axi_mem_intercon_writer/S01_ARESETN] [get_bd_pins axi_mem_intercon_writer/S02_ARESETN]
connect_bd_net [get_bd_pins S03_ARESETN] [get_bd_pins axi_write_prova_0/ap_rst_n] [get_bd_pins axi_mem_intercon_writer/S03_ARESETN]

current_bd_instance /
connect_bd_intf_net [get_bd_intf_pins OV7670_GRAYSCALE_TO_AXIS/AXIM_READER_SD] [get_bd_intf_pins zynq_ultra_ps_e_0/S_AXI_HP2_FPD]
connect_bd_intf_net [get_bd_intf_pins OV7670_GRAYSCALE_TO_AXIS/outStream_V_V] [get_bd_intf_pins VDMA/AXIS_IN]
connect_bd_intf_net [get_bd_intf_pins OV7670_GRAYSCALE_TO_AXIS/outStream_raw_CHROMA] [get_bd_intf_pins VDMA/AXIS_IN_RAW_CHROMA]
connect_bd_intf_net [get_bd_intf_pins OV7670_GRAYSCALE_TO_AXIS/outStream_raw_LUMA] [get_bd_intf_pins VDMA/AXIS_IN_RAW_LUMA]
connect_bd_intf_net [get_bd_intf_pins OV7670_GRAYSCALE_TO_AXIS/S00_AXI] [get_bd_intf_pins zynq_ultra_ps_e_0/M_AXI_HPM1_FPD]
connect_bd_intf_net [get_bd_intf_pins processing_system7_0_axi_periph/S00_AXI] [get_bd_intf_pins zynq_ultra_ps_e_0/M_AXI_HPM0_FPD]
connect_bd_intf_net [get_bd_intf_pins VDMA/AXIM_READER] [get_bd_intf_pins zynq_ultra_ps_e_0/S_AXI_HP0_FPD]
connect_bd_intf_net [get_bd_intf_pins VDMA/AXIM_WRITER] [get_bd_intf_pins zynq_ultra_ps_e_0/S_AXI_HP1_FPD]
connect_bd_intf_net [get_bd_intf_pins axi_gpio_frame_intr/S_AXI] [get_bd_intf_pins processing_system7_0_axi_periph/M00_AXI]
connect_bd_intf_net [get_bd_intf_pins axi_gpio_pl_reset/S_AXI] [get_bd_intf_pins processing_system7_0_axi_periph/M01_AXI]
connect_bd_intf_net [get_bd_intf_pins VDMA/s_axi_AXILiteS] [get_bd_intf_pins processing_system7_0_axi_periph/M02_AXI]
connect_bd_intf_net [get_bd_intf_pins VDMA/s_axi_AXILiteS1] [get_bd_intf_pins processing_system7_0_axi_periph/M03_AXI]
connect_bd_intf_net [get_bd_intf_pins VDMA/s_axi_AXILite_raw_LUMA] [get_bd_intf_pins processing_system7_0_axi_periph/M04_AXI]
connect_bd_intf_net [get_bd_intf_pins VDMA/s_axi_AXILite_raw_CHROMA] [get_bd_intf_pins processing_system7_0_axi_periph/M05_AXI]
connect_bd_net [get_bd_pins ENABLE_RAW_STREAM/dout] [get_bd_pins OV7670_GRAYSCALE_TO_AXIS/enable_raw_stream]
connect_bd_net -net OV7670_GRAYSCALE_TO_AXIS_Q [get_bd_pins OV7670_GRAYSCALE_TO_AXIS/LED_FRAME_VALID] [get_bd_ports LED_FRAME_VALID]
connect_bd_net [get_bd_ports PCLK] \
  [get_bd_pins reset_24M/slowest_sync_clk] [get_bd_pins zynq_ultra_ps_e_0/maxihpm1_fpd_aclk] \
  [get_bd_pins zynq_ultra_ps_e_0/saxihp2_fpd_aclk] [get_bd_pins OV7670_GRAYSCALE_TO_AXIS/ap_clk] [get_bd_pins VDMA/clk_in]
connect_bd_net -net ap_start_1 [get_bd_pins const_true/dout] [get_bd_pins OV7670_GRAYSCALE_TO_AXIS/ap_start]
connect_bd_net [get_bd_pins axi_gpio_frame_intr/ip2intc_irpt] [get_bd_pins zynq_ultra_ps_e_0/pl_ps_irq0]
connect_bd_net -net axis_to_ddr_writer_0_frame_index_V [get_bd_pins VDMA/frame_index_V] [get_bd_pins axi_gpio_frame_intr/gpio_io_i]
connect_bd_net [get_bd_pins clk_wiz_0/clk_out1] [get_bd_ports XCLK]
connect_bd_net [get_bd_ports data_in_V] [get_bd_pins OV7670_GRAYSCALE_TO_AXIS/data_in]
connect_bd_net -net ext_reset_in_1 [get_bd_pins axi_gpio_pl_reset/gpio_io_o] [get_bd_ports OV7670_RESET]
connect_bd_net [get_bd_ports href_V] [get_bd_pins OV7670_GRAYSCALE_TO_AXIS/href]
connect_bd_net -net proc_sys_reset_0_peripheral_aresetn [get_bd_pins reset_24M/peripheral_aresetn] \
  [get_bd_pins OV7670_GRAYSCALE_TO_AXIS/ap_rst_n] [get_bd_pins VDMA/aresetn_in]
connect_bd_net [get_bd_pins proc_sys_reset_0/peripheral_aresetn] [get_bd_pins axi_gpio_pl_reset/s_axi_aresetn] [get_bd_pins VDMA/S03_ARESETN]
connect_bd_net [get_bd_pins reset_24M/peripheral_reset] [get_bd_pins OV7670_GRAYSCALE_TO_AXIS/ap_rst]
connect_bd_net -net rst_processing_system7_0_100M_interconnect_aresetn [get_bd_pins reset_100M/interconnect_aresetn] \
  [get_bd_pins VDMA/interconnect_aresetn]
connect_bd_net -net rst_processing_system7_0_100M_peripheral_aresetn [get_bd_pins reset_100M/peripheral_aresetn] \
  [get_bd_pins axi_gpio_frame_intr/s_axi_aresetn] [get_bd_pins VDMA/aresetn_vdma]
connect_bd_net [get_bd_ports vsync_V] [get_bd_pins OV7670_GRAYSCALE_TO_AXIS/vsync]
connect_bd_net -net xlconstant_0_dout [get_bd_pins proc_sys_reset_0/interconnect_aresetn] \
  [get_bd_pins processing_system7_0_axi_periph/ARESETN] [get_bd_pins processing_system7_0_axi_periph/M00_ARESETN] \
  [get_bd_pins processing_system7_0_axi_periph/M01_ARESETN] [get_bd_pins processing_system7_0_axi_periph/M02_ARESETN] \
  [get_bd_pins processing_system7_0_axi_periph/M03_ARESETN] [get_bd_pins processing_system7_0_axi_periph/M04_ARESETN] \
  [get_bd_pins processing_system7_0_axi_periph/M05_ARESETN] [get_bd_pins processing_system7_0_axi_periph/S00_ARESETN]
connect_bd_net [get_bd_pins zynq_ultra_ps_e_0/pl_clk0] \
  [get_bd_pins zynq_ultra_ps_e_0/saxihp1_fpd_aclk] [get_bd_pins zynq_ultra_ps_e_0/saxihp0_fpd_aclk] \
  [get_bd_pins zynq_ultra_ps_e_0/maxihpm0_fpd_aclk] [get_bd_pins axi_gpio_frame_intr/s_axi_aclk] \
  [get_bd_pins reset_100M/slowest_sync_clk] [get_bd_pins axi_gpio_pl_reset/s_axi_aclk] [get_bd_pins clk_wiz_0/clk_in1] \
  [get_bd_pins proc_sys_reset_0/slowest_sync_clk] [get_bd_pins processing_system7_0_axi_periph/ACLK] \
  [get_bd_pins processing_system7_0_axi_periph/S00_ACLK] [get_bd_pins processing_system7_0_axi_periph/M00_ACLK] \
  [get_bd_pins VDMA/clk_vdma] [get_bd_pins processing_system7_0_axi_periph/M01_ACLK] \
  [get_bd_pins processing_system7_0_axi_periph/M02_ACLK] [get_bd_pins processing_system7_0_axi_periph/M03_ACLK] \
  [get_bd_pins processing_system7_0_axi_periph/M04_ACLK] [get_bd_pins processing_system7_0_axi_periph/M05_ACLK]
connect_bd_net [get_bd_pins zynq_ultra_ps_e_0/pl_resetn0] \
  [get_bd_pins proc_sys_reset_0/ext_reset_in] [get_bd_pins reset_100M/ext_reset_in] [get_bd_pins reset_24M/ext_reset_in]

# ---- address map ----
assign_bd_address -offset 0x00000000 -range 2G -target_address_space [get_bd_addr_spaces OV7670_GRAYSCALE_TO_AXIS/ddr_to_axis_reader_SD_0/Data_m_axi_base_ddr_addr] [get_bd_addr_segs zynq_ultra_ps_e_0/SAXIGP4/HP2_DDR_LOW]
assign_bd_address -offset 0xFF000000 -range 16M -target_address_space [get_bd_addr_spaces OV7670_GRAYSCALE_TO_AXIS/ddr_to_axis_reader_SD_0/Data_m_axi_base_ddr_addr] [get_bd_addr_segs zynq_ultra_ps_e_0/SAXIGP4/HP2_LPS_OCM]
assign_bd_address -offset 0x00000000 -range 2G -target_address_space [get_bd_addr_spaces VDMA/axi_write_prova_0/Data_m_axi_base_ddr_addr] [get_bd_addr_segs zynq_ultra_ps_e_0/SAXIGP3/HP1_DDR_LOW]
exclude_bd_addr_seg -offset 0xFF000000 -range 16M -target_address_space [get_bd_addr_spaces VDMA/axi_write_prova_0/Data_m_axi_base_ddr_addr] [get_bd_addr_segs zynq_ultra_ps_e_0/SAXIGP3/HP1_LPS_OCM]
assign_bd_address -offset 0x00000000 -range 2G -target_address_space [get_bd_addr_spaces VDMA/axi_write_prova_0/Data_m_axi_frame_index] [get_bd_addr_segs zynq_ultra_ps_e_0/SAXIGP3/HP1_DDR_LOW]
exclude_bd_addr_seg -offset 0xFF000000 -range 16M -target_address_space [get_bd_addr_spaces VDMA/axi_write_prova_0/Data_m_axi_frame_index] [get_bd_addr_segs zynq_ultra_ps_e_0/SAXIGP3/HP1_LPS_OCM]
assign_bd_address -offset 0x00000000 -range 2G -target_address_space [get_bd_addr_spaces VDMA/axis_to_ddr_writer_CHROMA/Data_m_axi_base_ddr_addr] [get_bd_addr_segs zynq_ultra_ps_e_0/SAXIGP3/HP1_DDR_LOW]
assign_bd_address -offset 0xFF000000 -range 16M -target_address_space [get_bd_addr_spaces VDMA/axis_to_ddr_writer_CHROMA/Data_m_axi_base_ddr_addr] [get_bd_addr_segs zynq_ultra_ps_e_0/SAXIGP3/HP1_LPS_OCM]
assign_bd_address -offset 0x00000000 -range 2G -target_address_space [get_bd_addr_spaces VDMA/axis_to_ddr_writer_LUMA/Data_m_axi_base_ddr_addr] [get_bd_addr_segs zynq_ultra_ps_e_0/SAXIGP3/HP1_DDR_LOW]
assign_bd_address -offset 0xFF000000 -range 16M -target_address_space [get_bd_addr_spaces VDMA/axis_to_ddr_writer_LUMA/Data_m_axi_base_ddr_addr] [get_bd_addr_segs zynq_ultra_ps_e_0/SAXIGP3/HP1_LPS_OCM]
assign_bd_address -offset 0x00000000 -range 2G -target_address_space [get_bd_addr_spaces VDMA/ddr_to_axis_reader_0/Data_m_axi_base_ddr_addr] [get_bd_addr_segs zynq_ultra_ps_e_0/SAXIGP2/HP0_DDR_LOW]
assign_bd_address -offset 0xFF000000 -range 16M -target_address_space [get_bd_addr_spaces VDMA/ddr_to_axis_reader_0/Data_m_axi_base_ddr_addr] [get_bd_addr_segs zynq_ultra_ps_e_0/SAXIGP2/HP0_LPS_OCM]
assign_bd_address -offset 0x000A0000000 -range 64K -target_address_space [get_bd_addr_spaces zynq_ultra_ps_e_0/Data] [get_bd_addr_segs VDMA/axi_write_prova_0/s_axi_AXILiteS/Reg]
assign_bd_address -offset 0x000A0010000 -range 64K -target_address_space [get_bd_addr_spaces zynq_ultra_ps_e_0/Data] [get_bd_addr_segs VDMA/axis_to_ddr_writer_CHROMA/s_axi_AXILiteS/Reg]
assign_bd_address -offset 0x000A0020000 -range 64K -target_address_space [get_bd_addr_spaces zynq_ultra_ps_e_0/Data] [get_bd_addr_segs VDMA/axis_to_ddr_writer_LUMA/s_axi_AXILiteS/Reg]
assign_bd_address -offset 0x000A0030000 -range 64K -target_address_space [get_bd_addr_spaces zynq_ultra_ps_e_0/Data] [get_bd_addr_segs VDMA/ddr_to_axis_reader_0/s_axi_AXILiteS/Reg]
assign_bd_address -offset 0x000A0040000 -range 4K -target_address_space [get_bd_addr_spaces zynq_ultra_ps_e_0/Data] [get_bd_addr_segs axi_gpio_frame_intr/S_AXI/Reg]
assign_bd_address -offset 0x000A0041000 -range 4K -target_address_space [get_bd_addr_spaces zynq_ultra_ps_e_0/Data] [get_bd_addr_segs axi_gpio_pl_reset/S_AXI/Reg]
assign_bd_address -offset 0x000B0000000 -range 64K -target_address_space [get_bd_addr_spaces zynq_ultra_ps_e_0/Data] [get_bd_addr_segs OV7670_GRAYSCALE_TO_AXIS/ddr_to_axis_reader_SD_0/s_axi_AXILiteS/Reg]
assign_bd_address -offset 0x000B0010000 -range 64K -target_address_space [get_bd_addr_spaces zynq_ultra_ps_e_0/Data] [get_bd_addr_segs OV7670_GRAYSCALE_TO_AXIS/mux_sd_ov_1/s_axi_AXILiteS/Reg]

validate_bd_design
save_bd_design
